# EAGLE design source_eagle (EAGLE 9.6.2)
COMPANY: ADAFRUIT INDUSTRIES; DRAWN: KTOWN; REV: A
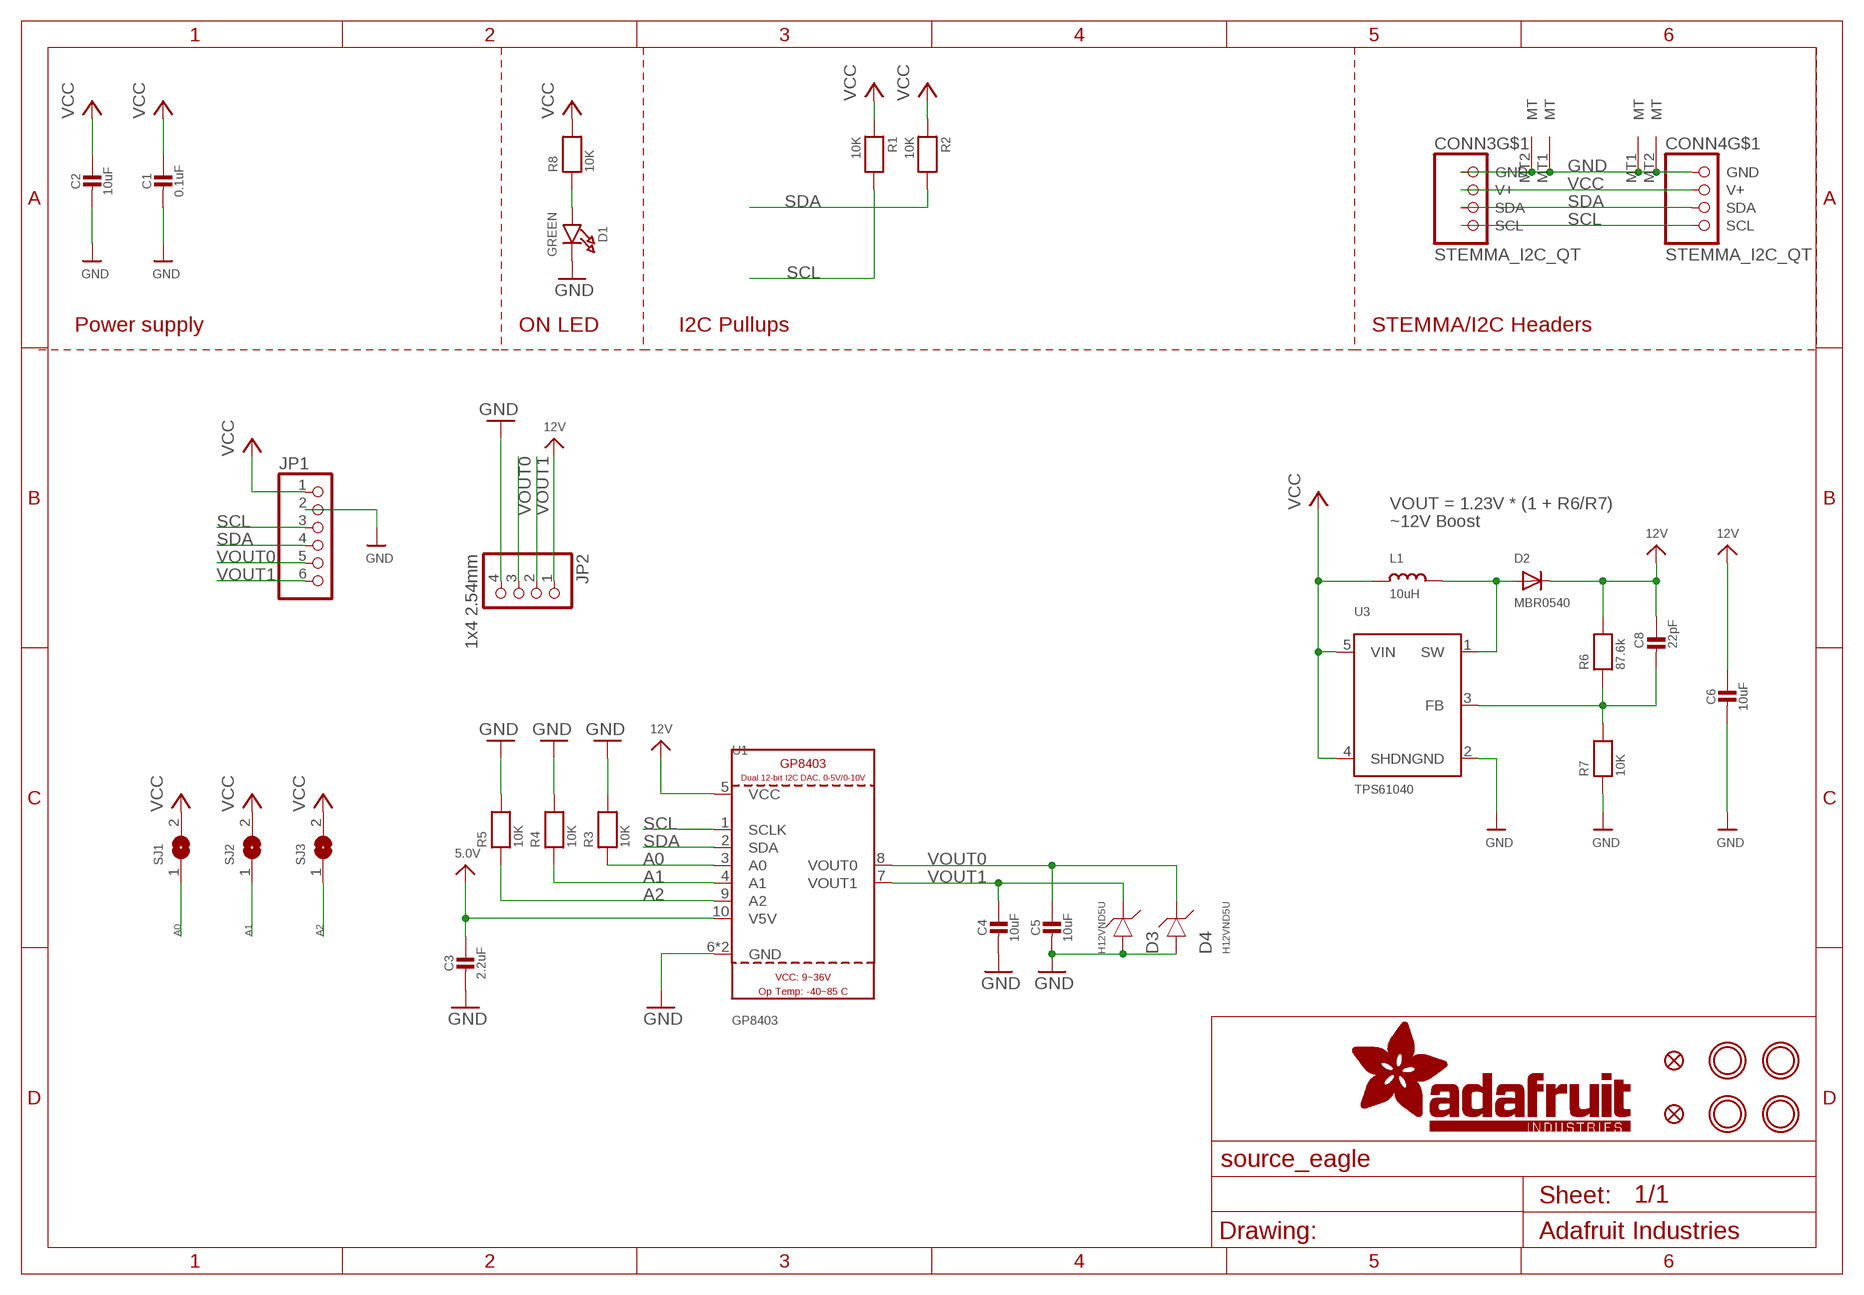
[diagram p0: schematic, sheet 1]

## Parts
C1  0.1uF  CAP_CERAMIC0603_NO  [0603-NO]
C2  10uF  CAP_CERAMIC0805-NOOUTLINE  [0805-NO]
C3  2.2uF  CAP_CERAMIC0603_NO  [0603-NO]
C4  10uF  CAP_CERAMIC0805-NOOUTLINE  [0805-NO]
C5  10uF  CAP_CERAMIC0805-NOOUTLINE  [0805-NO]
C6  10uF  CAP_CERAMIC0805-NOOUTLINE  [0805-NO]
C8  22pF  CAP_CERAMIC0603_NO  [0603-NO]
CONN3  STEMMA_I2C_QT  [JST_SH4]
CONN4  STEMMA_I2C_QT  [JST_SH4]
D1  GREEN  LED0603_NOOUTLINE  [CHIPLED_0603_NOOUTLINE]
D2  MBR0540  DIODE_MINISOD123  [SOD-123FL]
D3  H12VND5U  TVS_SOD523  [SOD-523]
D4  H12VND5U  TVS_SOD523  [SOD-523]
FID3  FIDUCIAL_0.5MM  [FIDUCIAL_0.5MM]
FID4  FIDUCIAL_0.5MM  [FIDUCIAL_0.5MM]
JP1  HEADER-1X670MIL  [1X06_ROUND_70]
JP2  1x4 2.54mm  HEADER-1X4_254MMTERM  [1X04_2.54MMTERMINAL]
L1  10uH  INDUCTOR  [INDUCTOR_1007]
R1  10K  RESISTOR_0603_NOOUT  [0603-NO]
R2  10K  RESISTOR_0603_NOOUT  [0603-NO]
R3  10K  RESISTOR_0603_NOOUT  [0603-NO]
R4  10K  RESISTOR_0603_NOOUT  [0603-NO]
R5  10K  RESISTOR_0603_NOOUT  [0603-NO]
R6  87.6k  RESISTOR_0603_NOOUT  [0603-NO]
R7  10K  RESISTOR_0603_NOOUT  [0603-NO]
R8  10K  RESISTOR_0603_NOOUT  [0603-NO]
SJ1  SOLDERJUMPER  [SOLDERJUMPER_ARROW_NOPASTE]
SJ2  SOLDERJUMPER  [SOLDERJUMPER_ARROW_NOPASTE]
SJ3  SOLDERJUMPER  [SOLDERJUMPER_ARROW_NOPASTE]
U1  GP8403  DAC_GP8403  [ESSOP10-EP]
U3  TPS61040  VREG_BOOST_5PIN_SOT23  [SOT23-5]
U$1  MOUNTINGHOLE2.5  [MOUNTINGHOLE_2.5_PLATED]
U$17  MOUNTINGHOLE2.5  [MOUNTINGHOLE_2.5_PLATED]
U$19  MOUNTINGHOLE2.5  [MOUNTINGHOLE_2.5_PLATED]
U$21  MOUNTINGHOLE2.5  [MOUNTINGHOLE_2.5_PLATED]

## Nets
5.0V: C3.1 U1.10(V5V)
12V: C6.1 C8.1 D2.C JP2.1 R6.2 U1.5(VCC)
A0: R3.1 SJ1.1 U1.3(A0)
A1: R4.1 SJ2.1 U1.4(A1)
A2: R5.1 SJ3.1 U1.9(A2)
GND [lowpower]: C1.2 C2.2 C3.2 C4.2 C5.2 C6.2 CONN3.1(GND) CONN3.MT1(MT) CONN3.MT2(MT) CONN4.1(GND) CONN4.MT1(MT) CONN4.MT2(MT) D1.C D3.A D4.A JP1.2 JP2.4 R3.2 R4.2 R5.2 R7.1 U1.6(GND) U1.EP(GND) U3.2(GND)
N$1: D1.A R8.1
N$5: D2.A L1.P$2 U3.1(SW)
N$8: C8.2 R6.1 R7.2 U3.3(FB)
SCL: CONN3.4(SCL) CONN4.4(SCL) JP1.3 R1.2 U1.1(SCLK)
SDA: CONN3.3(SDA) CONN4.3(SDA) JP1.4 R2.2 U1.2(SDA)
VCC [lowpower]: C1.1 C2.1 CONN3.2(V+) CONN4.2(V+) JP1.1 L1.P$1 R1.1 R2.1 R8.2 SJ1.2 SJ2.2 SJ3.2 U3.4(SHDN) U3.5(VIN)
VOUT0: C5.1 D4.K(C) JP1.5 JP2.3 U1.8(VOUT0)
VOUT1: C4.1 D3.K(C) JP1.6 JP2.2 U1.7(VOUT1)

## Notes on the sheet
- Power supply | ON LED | I2C Pullups | STEMMA/I2C Headers
- VOUT = 1.23V * (1 + R6/R7)
- ~12V Boost

## Library data of the parts
C1-C6 C8 = microbuilder:CAP_CERAMIC: Ceramic Capacitors For new designs, use the packages preceded by an '_' character since they are more reliable: The following footprints should be used on most boards: _0402 - Standard footprint for regular board layouts _0603 - Standard footprint for regular board layouts _0805 - Standard footprint for regular board layouts _1206 - Standard footprint for regular board layouts For extremely tight-pitch boards where space is at a premium, the following 'micro-pitch' footprints can be used (smaller pads, no silkscreen outline, etc.): _0402MP - Micro-pitch footprint for very dense/compact boards _0603MP - Micro-pitch footprint for very dense/compact boards _0805MP - Micro-pitch footprint for very dense/compact boards _1206MP - Micro-pitch footprint for very dense/compact boards
CONN3 CONN4 = adafruit_electromech:STEMMA_I2C; LCSC: C2905006
D1 = microbuilder:LED: LED 0603 - 0603 Surface Mount Package 2mA: Green LED - Low Power (3.9mcd, 2ma, 1.7Vf) - Digikey: 475-2709-2-ND Orange LED - Low Power (9.8mcd, 2ma, 1.8Vf) - Digikey: 475-1194-2-ND Red LED - Low Power (5mcd, 2ma, 1.8Vf) - Digikey: 475-1195-2-ND Yellow LED - Low Power (7mcd, 2ma, 1.8Vf) - Digikey: 475-1196-2-ND 5mA: Blue LED - Low Power (17mcd, 5ma, 2.9Vf) - Digikey: LNJ937W8CRACT-ND 0805 - 0805 Surface Mount Package 2mA: Red LED (8.8mcd, 2mA, 1.8Vf, Clear) - Low Power [Digikey: 475-2510-1-ND] Green LED (5mcd, 2mA, 1.8Vf, Clear) - Low Power [Digikey: 475-2730-1-ND] Yellow LED (11.3mcd, 2mA, 1.8Vf, Clear) - Low Power [Digikey: 475-2555-1-ND] 20mA: Red LED (104mcd, 20mA, Diffused) - LS R976 [Digikey: 475-1278-6-ND] Red LED (12mcd, 20mA, 2.0Vf, Clear) - APT2012EC [Digikey: 754-1128-1-ND] Green LED (15mcd, 20mA, 2.2Vf, Clear) - APT2012GC [Digikey: 754-1131-1-ND] Orange LED (160mcd, 20mA, 2.1Vf, Clear) - APT2012SECK [Digikey: 754-1130-1-ND] 1206 - 1206 Surface Mount Package Green LED (26mcd, 20mA, Diffused) - LG N971 [Digikey: 475-1407-6-ND] Red LED (15mcd, 20mA, Diffused) - LH N974 [Digikey: 475-1416-6-ND] Cree - Cree High-Power Surface Mount LEDs XPEBWT-L1-0000-00D50 - White 111lm 350mA 2.9Vf 6200K 110° XTEAWT-00-0000-00000LEE3 - White 114lm 350mA 2.85Vf 5000K 115° Everlight - Everlight 45-21 Series Surface Mount LEDs 45-21/QK2C-B2832AC2CB2/2T - Warm White 2000mcd 20mA 3.25Vf 3050K 120° 45-21/LK2C-B38452C4CB2/2T - Nuetral White 2000mcd 20mA 3.25Vf 4150K 120° 45-21/LK2C-B50634C6CB2/2T - Cold White 2200mcd 20mA 3.25Vf 5650K 120° PLCC2 Reverse Mount LS T77K-J1L2-1-0-2-R18-Z - Red 11.25mcd 2mA 1.8Vf 630nm 120° LO T77K-L1M2-24-Z - Orange 19.6mcd 2mA 1.8Vf 606nm 120° LY T77K-K2M1-26-Z - Yellow 15.7mcd 2mA 1.8Vf 587nm 120°; ROT: 270
D2 = microbuilder:DIODE: Diode SMA Model Volts Amps Type Vf Ir Digikey # Notes SSA34-E3 40V 3A Schottky 480mV @ 3A 200uA @ 40V SSA34-E3/61TGITR-ND CDBA120-G 20V 1A Schottky 500mV @ 1A 500uA @ 20V 641-1014-6-ND REEL MBRA210 10V 2A Schottky 350mV @ 2A 700uA @ 10V MBRA210LT3 SOD-123 Model Volts Amps Type Vf Ir Order # Notes BAT54T1G 30V 200mA Schottky 800mV @ 200mA 2uA @ 25V BAT54T1GOSTR-ND B0530W 30V 500mA Schottky 430mV @ 500mA 130uA @ 30V B0530W-FDICT-ND REEL MBR120 20V 1A Schottky 340mV @ 1A MBR120VLSFT1GOSCT-ND SOD-323 Model Volts Amps Type Vf Ir Order # Notes PMEG2005EJ 20V 500mA Schottky 355mV @ 500mA 568-4110-1-ND ZLLS410 10V 570mA Schottky 380mV @ 570mA ZLLS410CT-ND 1N4148WS 75V 150mA Silicon/Simple 1V 1N4148WSFSCT-ND REEL SOD-523 Model Volts Amps Type Vf Ir Order # Notes BAT54XV2 30V 200mA Schottky 0.8V @ 100mA BAT54XV2CT-ND TB751S 30V 30mA Schottky RB751S-40TE61CT-ND SOT23-R/W (R = Solder Paste/Reflow Ovens, W = Hand-Soldering) Model Volts Amps Type Vf Ir Order # Notes BAT54FILM 40V 300mA Schottky 497-7162-1-ND POWERDI-5 Model Volts Amps Type Vf Ir Order # Notes PDS560 60V 5A Schottky 670mV @ 5A 150uA @ 60V PDS560DICT-ND
D3 D4 = adafruit_power:TVS
FID3 FID4 = microbuilder:FIDUCIAL: Fiducial Alignment Points Various fiducial points for machine vision alignment.
JP1 = microbuilder:HEADER-1X6: PIN HEADER
JP2 = microbuilder:HEADER-1X4: PIN HEADER
L1 = microbuilder:INDUCTOR: Inductors 0603: 10nH Ceramic Inductor - microwire antenna/RF (Digikey: 712-1434-2-ND) 0805: 560nH Ceramic Inductor - RF (Digikey: 553-1047-1-ND) 270nH Ceramic Inductor - Q = 40@250MHz, +-5%, 1 Ohm DC Resistance (Digikey: 535-10506-2-ND) 1007 (2518 Metric) SMT: 10µH 10% 250mOhm 820mA 1007 Inductor (Digikey: 587-2189-1-ND) 22µH 10% 500mOhm 580mA 1007 Inductor (Digikey: 587-2190-1-ND) 47µH 10% 950mOhm 420mA 1007 Inductor (Digikey: 587-2191-1-ND) 47µH 5% 100mOhm 1A 1008 Inductor (Digikey: 732-1816-1-ND) 5.0x5.0mm (Taiyo Yuden NR5040 Series) 6.8µH 20% 2.3A 64mOhm Inductor (Digikey: 587-2374-2-ND) 5.0x5.0mm (TDK VLC5045 Series) 4.7µH 20% 3.3A 34mOhm Inductor (Digikey: 445-6526-1-ND) 6.8µH 20% 2.7A 46mOhm Inductor (Digikey: 445-6527-1-ND) 6.0x6.0mm (TDK VLC6045 Series) 4.7µH 20% 3.8A 27mOhm Inductor (Digikey: 445-6538-2-ND) 6.8µH 20% 3A 41mOhm Inductor (Digikey: 445-6540-1-ND) 6.2µH 30% 2.2A 45mOhm Inductor (Digikey: SRR5028-6R2YCT-ND) - Not TDK VLC6045 but footprint should match 6.0x6.0mm (TDK SLF6045 Series) 6.8uH 30% 2A 33mOhm Inductor (Digikey: 445-4572-1-ND, Mouser: 810-SLF645T6R8N2R0PF) 6.0x6.0mm (Sumida CDRH5D28 Series) 6.2uH 30% 1.8A 45mOhm Inductor (Digikey: 308-1542-1-ND) Taiyo Yuden NR3015T2R2M - 2.2uH 20% 1.5A (Digikey: 587-1648-2-ND, Mouser: 963-NR3015T2R2M) - Used with TI TPS62172 CoilCraft RFID Transponder Coil - MA5532-AE (For use with AS3935 Lightning Sensor) Taiyo Yuden NRH2412T2R2MNGH - 2.2uH 20% 1AA (Digikey: 587-3443-1-ND) - Used with TI LM3671 Vishay IHLP 1.0uH Molded Inductor - 24mOhm DCR, 5A, +/-20%, -55°C-125°C (Digikey: 541-1319-1-ND)
R1-R8 = microbuilder:RESISTOR: Resistors For new designs, use the packages preceded by an '_' character since they are more reliable: The following footprints should be used on most boards: _0402 - Standard footprint for regular board layouts _0603 - Standard footprint for regular board layouts _0805 - Standard footprint for regular board layouts _1206 - Standard footprint for regular board layouts For extremely tight-pitch boards where space is at a premium, the following 'micro-pitch' footprints can be used (smaller pads, no silkscreen outline, etc.): _0402MP - Micro-pitch footprint for very dense/compact boards _0603MP - Micro-pitch footprint for very dense/compact boards _0805MP - Micro-pitch footprint for very dense/compact boards _1206MP - Micro-pitch footprint for very dense/compact boards
SJ1-SJ3 = microbuilder:SOLDERJUMPER: SMD Solder JUMPER Solder the two pads together to create a connection, or remove the solder to break it. REFLOW - Use this footprint for solder paste and reflow ovens. WAVE - Use this footprint for hand-soldering (larger pads). CLOSED - Has a trace between the two pads to ensure it is closed by default. The trace needs to be cut to disable the jumper, and can be closed again by creating a solder bridge between the two pads.; BOM: EXCLUDE
U1 = microbuilder:DAC_GP8403: GP8403 - Dual 12-bit I2C DAC Guestgood GP8403-TC50-EW. Two-channel 12-bit (0x000-0xFFF) DAC with selectable 0-5V or 0-10V analog outputs over I2C. VCC supply 9V-36V, internal 5V LDO (V5V, needs >1uF decoupling), 3-bit hardware I2C address (A0/A1/A2). Output short-circuit protection. ESSOP-10 with exposed thermal pad (tie to GND). LCSC C3152007.
U3 = adafruit_power:VREG_BOOST_5PIN: FAN5331 - LED/OLED 20V Boost Converter Digikey: FAN5331SXCT-ND; ROT: 270
U$1 U$17 U$19 U$21 = adafruit_electromech:MOUNTINGHOLE: Mounting Hole For #2 screws (0.086"/2.18mm width, 0.094"/2.4mm hole) use 2.5mm; BOM: EXCLUDE

## Net classes
1 highpower: width 0.406 mm, drill 0.483 mm
2 lowpower: width 0.305 mm, drill 0.483 mm

## Board
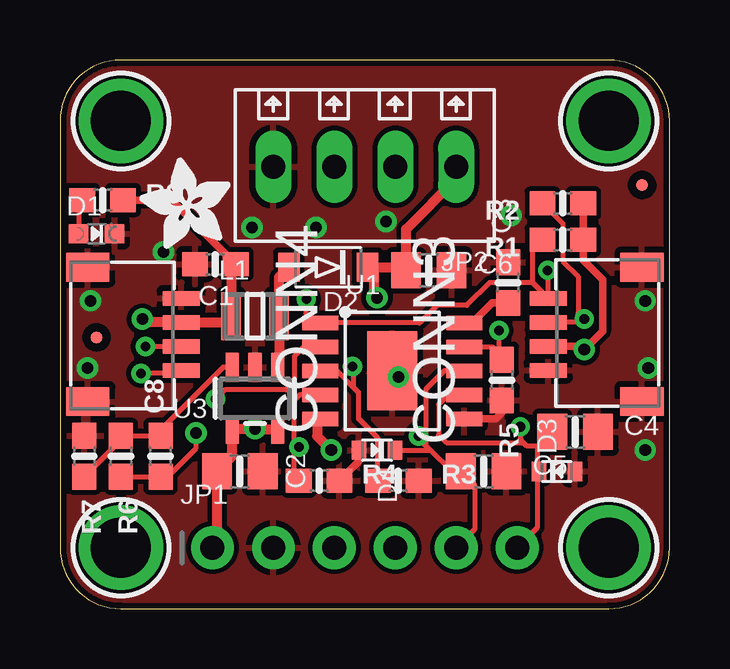
[diagram p1: board, top side]
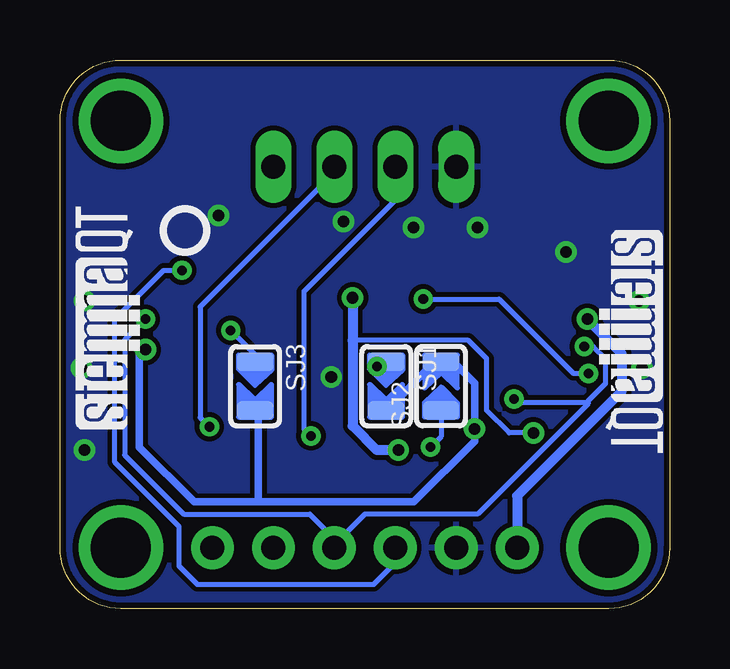
[diagram p2: board, bottom side, seen from below]

Size 25.4 x 22.86 mm. Coordinates in mm from the lower left corner, seen from the top.
Outline: 0,20.32 0,2.54 arc90 2.54,0 22.86,0 arc90 25.4,2.54 25.4,20.32 arc90 22.86,22.86 2.54,22.86 arc90 0,20.32
Copper layers (1*16): Top 0.035mm / dielectric 1.5mm / Bottom 0.035mm
Design rules "adafruit *": minimum track width 8mil, minimum drill 15.5mil, track to track 8mil, track to pad 8mil, pad to pad 8mil, via to via 8mil, smd to smd 8mil, copper to edge 10mil, drill to drill 8mil, minimum pad ring 10mil, minimum via ring 8mil, stop-mask expansion 2mil, vias tented up to drill 20mil, thermal gap 10mil

### Footprints (pad centres in the part's own frame; a part is rotated, then mirrored left to right if it is on the bottom)
0603-NO = smd 1.075 x 1: 1 -0.85,0; 2 0.85,0
0805-NO = smd 1.24 x 1.5: 1 -0.95,0; 2 0.95,0
JST_SH4 = smd 0.6 x 1.55: 1 -1.5,2.006; 2 -0.5,2.006; 3 0.5,2.006; 4 1.5,2.006 | smd 1.2 x 1.8: MT1 -2.8,-1.894; MT2 2.8,-1.894
CHIPLED_0603_NOOUTLINE = smd 0.8 x 0.8: A 0,-0.75; C 0,0.75
SOD-123FL = smd 0.91 x 1.22: A 1.637,0; C -1.637,0
SOD-523 = smd 0.8 x 0.6: A 0,-0.75; K 0,0.75
FIDUCIAL_0.5MM = smd 0.5 x 0.5: 1 0,0
1X06_ROUND_70 = drill 1 pad 1.778: 1 -6.35,0; 2 -3.81,0; 3 -1.27,0; 4 1.27,0; 5 3.81,0; 6 6.35,0
1X04_2.54MMTERMINAL = drill 1 long: 1 -3.81,0; 2 -1.27,0; 3 1.27,0; 4 3.81,0
INDUCTOR_1007 = smd 0.8 x 2: P$1 -1,0; P$2 1,0
SOLDERJUMPER_ARROW_NOPASTE = smd 0.762 x 1.524: 1 -1.016,0; 2 1.016,0
ESSOP10-EP = smd 0.6 x 1.5: 1 -2,-3; 2 -1,-3; 3 0,-3; 4 1,-3; 5 2,-3; 6 2,3; 7 1,3; 8 0,3; 9 -1,3; 10 -2,3 | smd 3.3 x 2.1: EP 0,0
SOT23-5 = smd 0.55 x 1.2: 1 -0.95,-1.3; 2 0,-1.3; 3 0.95,-1.3; 4 0.95,1.3; 5 -0.95,1.3
MOUNTINGHOLE_2.5_PLATED = drill 2.5 pad 3.2: P$1 0,0

### Placement (x,y rotation side)
C1  6.48,14.35 180 top
C2  7.49,5.71 0 top
C3  18.67,13.59 90 top
C4  21.46,7.37 0 top
C5  17.65,5.71 0 top
C6  15.37,14.1 0 top
C8  4.19,6.35 90 top
CONN3  22.35,11.43 90 top
CONN4  3.05,11.43 270 top
D1  1.52,15.62 270 top
D2  11.18,14.22 180 top
D3  20.7,5.71 90 top
D4  13.21,6.6 270 top
FID3  1.52,11.3 0 top
FID4  24.26,17.65 0 top
JP1  12.7,2.54 0 top
JP2  12.7,18.41 180 top
L1  8.13,12.19 0 top
PLABEL0  [PLABEL0]  6.35,0.89 0 top
PLABEL1  [PLABEL1]  9.02,4.19 0 top
PLABEL2  [PLABEL2]  11.56,0.89 0 top
PLABEL3  [PLABEL3]  13.84,4.19 0 top
PLABEL4  [PLABEL4]  19.18,4.19 0 top
PLABEL5  [PLABEL5]  3.56,14.61 90 top
PLABEL6  [PLABEL6]  16.76,0.89 0 top
PLABEL7  [PLABEL7]  6.35,20.45 90 top
PLABEL8  [PLABEL8]  19.05,20.19 90 top
PLABEL9  [PLABEL9]  11.43,22.23 90 top
PLABEL10  [PLABEL10]  13.84,22.23 90 top
PLABEL11  [PLABEL11]  12.7,15.62 0 bottom
PLABEL12  [PLABEL12]  12.7,12.83 0 bottom
PLABEL13  [PLABEL13]  12.57,0.89 0 bottom
PLABEL14  [PLABEL14]  15.49,9.27 90 bottom
PLABEL15  [PLABEL15]  7.75,9.27 90 bottom
PLABEL16  [PLABEL16]  13.59,9.27 90 bottom
PLABEL17  [PLABEL17]  16.64,21.34 90 bottom
PLABEL18  [PLABEL18]  14.1,21.21 90 bottom
PLABEL19  [PLABEL19]  11.43,21.21 90 bottom
PLABEL20  [PLABEL20]  9.02,21.34 90 bottom
PLABEL21  [PLABEL21]  12.06,5.97 0 bottom
R1  20.95,15.37 180 top
R2  20.95,16.89 180 top
R3  14.1,5.33 0 top
R4  10.79,5.33 0 top
R5  18.41,9.53 270 top
R6  2.54,6.35 270 top
R7  1.02,6.35 270 top
R8  1.78,17.02 0 top
SJ1  11.81,9.27 270 bottom
SJ2  9.53,9.27 90 bottom
SJ3  17.27,9.27 270 bottom
U1  13.84,9.91 270 top
U3  8.13,8.76 180 top
U$1  2.54,20.32 0 top
U$9  [ADAFRUIT_3.5MM]  7.11,14.99 90 top
U$17  22.86,20.32 0 top
U$19  2.54,2.54 0 top
U$21  22.86,2.54 0 top
U$25  [PCBFEAT-REV-040]  20.19,15.75 0 bottom
U$30  [STEMMAQT]  22.1,7.49 90 bottom
U$31  [STEMMAQT]  2.92,15.75 270 bottom

### Tracks (layer width: path | path; a pad name or v marks a point on that pad's centre or on a via)
5.0V
  Top 0.305: U1.10 17.17,11.91 18.01,12.74 C3.1
12V  (via drill 0.48)
  Top 0.203: R6.2 C8.1 4.48,5.5 5.67,6.69 v5.67,7.32
  Top 0.305: JP2.1 16.51,17.91
  Top 0.406: U1.5 10.72,7.78 10.72,7.19 v11.3,6.6 | v13.21,12.95 13.07,12.95 13.07,13.97 D2.C 14.29,14.22 C6.1 14.42,15.81 16.51,17.91
  Bottom 0.203: 13.21,11.18 8.38,11.18 7.62,10.41 7.62,8.26 6.69,7.32 v5.67,7.32
  Bottom 0.406: v11.3,6.6 12.19,6.6 13.21,7.62 13.21,11.18 v13.21,12.95
A0  (via drill 0.4)
  Top 0.203: U1.3 11.54,9.91 12.25,9.2 | 12.25,9.2 12.43,9.02 12.43,7.93 13.25,7.11 R3.1 | 12.25,9.2 12.25,10.03 v12.19,10.09
  Bottom 0.203: v12.19,10.09 12.19,10.21 12.12,10.29 SJ1.1
A1  (via drill 0.4)
  Top 0.203: U1.4 9.99,8.91 9.74,8.65 9.74,6.73 | 9.74,6.73 9.74,5.54 R4.1 | 9.74,6.73 v9.96,6.73
  Bottom 0.203: SJ2.1 9.53,7.17 v9.96,6.73
A2  (via drill 0.4)
  Top 0.203: U1.9 18.01,10.91 18.29,10.63 | R5.1 18.33,10.46 18.33,10.59 18.29,10.63 | v18.29,11.6 18.29,10.63
  Bottom 0.203: SJ3.1 17.27,10.58 v18.29,11.6
GND  (via drill 0.48)
  Top 0.305: U1.6 18.15,7.91 18.41,8.17 R5.2 | D4.A 12.46,6.15 R4.2 | U1.EP v14.1,9.65
  other vias: 24.38,12.83 24.51,10.03 1.27,12.83 1.14,10.03 8,15.88 4.32,14.86 13.59,16.13 10.67,15.88 18.8,16.38 24.38,6.6
  pour Top: 0,22.86 25.4,22.86 25.4,0 0,0
  pour Bottom: 0,22.86 25.4,22.86 25.4,0 0,0
N$1
  Top 0.203: R8.1 0.77,16.86 D1.A
N$5
  Top 0.406: D2.A 9.13,13.81 L1.P$2 9.13,10.11 U3.1
N$8
  Top 0.203: U3.3 6.8,10.06 4.19,7.45 C8.2 R6.1 2.54,7.02 R7.2
SCL  (via drill 0.4)
  Top 0.203: v20.32,14.1 20.35,14.07 CONN3.4 19.7,13.58 | CONN4.4 4.93,9.8 v3.38,9.8 | v10.26,12.9 10.26,12.27 10.62,11.91 U1.1 14.98,11.91 15.71,12.64 16.96,12.64 17.9,13.58 19.7,13.58 | 19.7,13.58 19.7,14.96 R1.2
  Bottom 0.203: v20.32,14.1 21.08,14.1 23.11,12.06 23.11,6.1 20.45,3.43 20.45,1.78 19.68,1.02 12.32,1.02 11.43,1.91 JP1.3 | v10.26,12.9 7.11,12.9 4.01,9.8 v3.38,9.8
SDA  (via drill 0.4)
  Top 0.203: CONN4.3 v3.56,10.92 | CONN3.3 21.71,11.93 v21.84,12.06 21.59,12.32 21.59,13.84 20.95,14.48 20.95,16.04 R2.2 | U1.2 10.14,10.91 9.76,10.53 9.76,9.44 9.43,9.11 6.86,9.11 v6.48,8.73
  Bottom 0.203: v21.84,12.06 22.71,11.2 22.71,6.39 20.25,3.94 14.99,3.94 13.97,2.92 13.97,2.67 | 13.97,2.67 JP1.4 | 3.4,8.57 3.4,8.54 8,3.94 12.7,3.94 13.97,2.67 | v6.48,8.73 6.35,8.6 3.43,8.6 3.4,8.57 | 3.4,8.57 3.4,8.65 2.67,9.38 2.67,10.41 3.17,10.92 v3.56,10.92
VCC  (via drill 0.48)
  Top 0.305: CONN3.2 21.71,10.93 v21.84,10.79 22.61,11.56 22.61,13.71 21.8,14.51 R1.1 R2.1 | C1.1 4.66,17.02 R8.2
  Top 0.406: C1.1 7.13,14.15 L1.P$1 6.87,11.93 CONN4.2 3.69,11.93 3.62,12 3.56,11.94 v3.43,12.06 | JP1.1 6.54,2.73 C2.1 7.18,6.35 U3.4 7.21,7.49 v8.13,7.49 8.16,7.46 U3.5
  Bottom 0.305: 17.14,4.45 19.81,4.45 22.1,6.73 22.1,10.54 v21.84,10.79 | 17.14,4.45 10.67,4.45 8.13,6.99 v8.13,7.49 8.13,9.4 9.02,10.29 SJ2.2 9.78,10.29 SJ1.2 | SJ3.2 17.14,8.13 17.14,4.45
  Bottom 0.406: v3.43,12.06 1.99,10.63 1.99,9.05 6.35,4.7 JP1.1
VOUT0  (via drill 0.4)
  Top 0.203: U1.8 16,9.91 15.24,9.14 15.24,6.8 | 15.43,6.6 16.32,5.71 C5.1 17.27,5.15 17.27,3.3 JP1.5 | 15.43,6.6 15.24,6.8 | 15.24,6.8 14.94,7.09 v14.94,7.2 | D4.K 15.43,6.6
  Bottom 0.203: JP2.3 11.43,17.02 15.24,13.21 15.24,7.49 v14.94,7.2
VOUT1  (via drill 0.4)
  Top 0.203: JP1.6 19.88,3.37 19.88,5.71 | 19.88,5.71 19.88,6.73 C4.1 19.94,6.79 19.43,6.79 19.31,6.92 | U1.7 16.17,8.91 15.77,8.51 15.77,7.24 16.09,6.92 19.31,6.92 | v19.18,7.58 19.18,7.05 19.31,6.92 | D3.K 19.88,5.71
  Bottom 0.203: v19.18,7.58 19.56,7.96 19.56,12.57 13.97,18.16 JP2.2

### Text on the board
Pinguin_tBackup: 0 | 1 | GND | +12V | on | GND | SDA | OUT1 | VCC | SCL | OUT0
Pinguin_bBackup: GND | V0 | V1 | 12V | GP8403 | Dual 0-5/0-10V DAC / with 12V Booster+NVM | A1 | A0 | A2 | Default I2C Address 0x58 | VLogic/Vcc: 3-5VDC